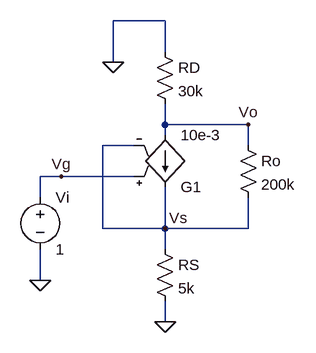
[diagram p0: schematic ideal_common_source.asc]
ideal_common_source.asc, the LTspice schematic file:
Version 4
SHEET 1 880 680
WIRE 144 -112 64 -112
WIRE 144 -64 144 -112
WIRE 64 -48 64 -112
WIRE 144 48 144 16
WIRE 272 48 144 48
WIRE 144 64 144 48
WIRE 96 80 48 80
WIRE 272 80 272 48
WIRE -16 128 -48 128
WIRE 96 128 -16 128
WIRE -48 160 -48 128
WIRE 48 208 48 80
WIRE 144 208 144 144
WIRE 144 208 48 208
WIRE 272 208 272 160
WIRE 272 208 144 208
WIRE 144 240 144 208
WIRE -48 288 -48 240
WIRE 144 352 144 320
FLAG 144 352 0
FLAG 64 -48 0
FLAG -48 288 0
FLAG 272 48 Vo
FLAG 144 208 Vs
FLAG -16 128 Vg
SYMBOL res 128 224 R0
SYMATTR InstName RS
SYMATTR Value 5k
SYMBOL res 128 -80 R0
SYMATTR InstName RD
SYMATTR Value 30k
SYMBOL res 256 64 R0
SYMATTR InstName Ro
SYMATTR Value 200k
SYMBOL g 144 160 M180
SYMATTR InstName G1
SYMATTR Value 10e-3
SYMBOL voltage -48 144 R0
SYMATTR InstName Vi
SYMATTR Value 1

The netlist it stands for:
* ideal_common_source.asc
RS Vs 0 5k
RD 0 Vo 30k
Ro Vo Vs 200k
G1 Vo Vs Vg Vs 10e-3
Vi Vg 0 1
.backanno
.end